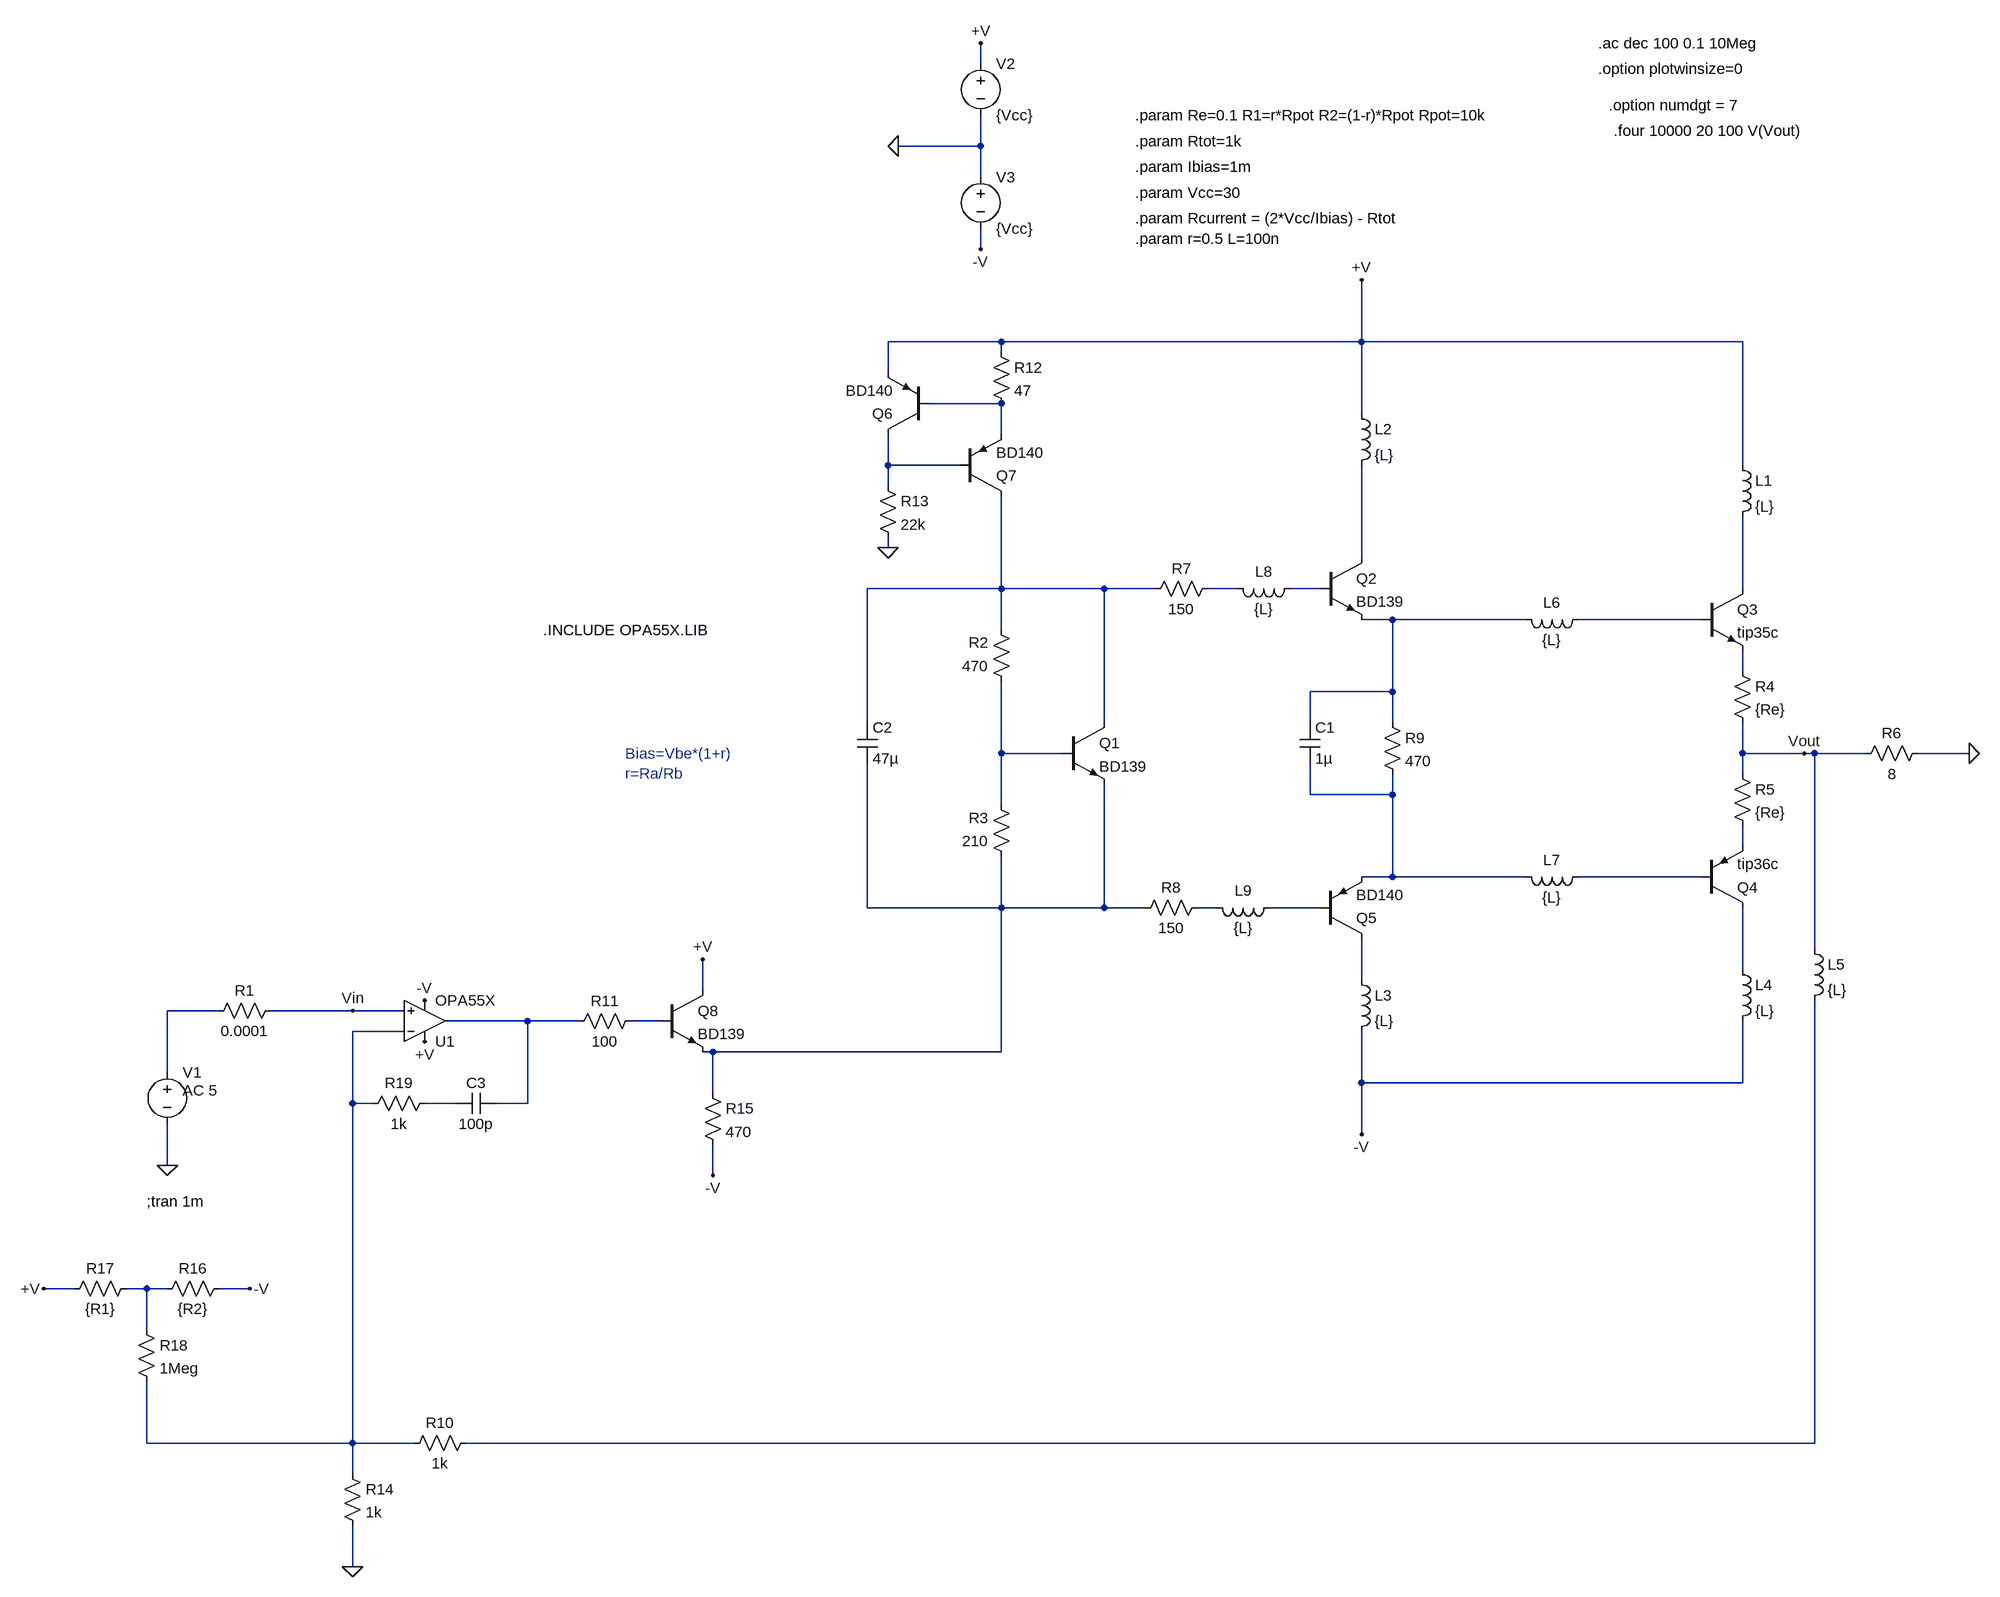
[diagram p0: schematic V3 inductance - AC.asc]
V3 inductance - AC.asc, the LTspice schematic file:
Version 4
SHEET 1 1460 1316
WIRE -96 -1664 -96 -1696
WIRE -96 -1536 -96 -1584
WIRE -96 -1536 -224 -1536
WIRE -96 -1488 -96 -1536
WIRE -96 -1376 -96 -1408
WIRE -64 -1232 -240 -1232
WIRE 496 -1232 496 -1328
WIRE 496 -1232 -64 -1232
WIRE 1088 -1232 496 -1232
WIRE -64 -1216 -64 -1232
WIRE -240 -1184 -240 -1232
WIRE -64 -1136 -176 -1136
WIRE 496 -1120 496 -1232
WIRE -64 -1088 -64 -1136
WIRE -240 -1040 -240 -1088
WIRE -128 -1040 -240 -1040
WIRE 1088 -1040 1088 -1232
WIRE -240 -1008 -240 -1040
WIRE -240 -912 -240 -928
WIRE 496 -896 496 -1040
WIRE -64 -848 -64 -992
WIRE -64 -848 -272 -848
WIRE 96 -848 -64 -848
WIRE 176 -848 96 -848
WIRE 304 -848 256 -848
WIRE 432 -848 384 -848
WIRE 1088 -848 1088 -960
WIRE 544 -800 496 -800
WIRE 752 -800 544 -800
WIRE 1024 -800 832 -800
WIRE -64 -784 -64 -848
WIRE 1088 -720 1088 -752
WIRE 544 -688 544 -800
WIRE 544 -688 416 -688
WIRE -272 -640 -272 -848
WIRE 96 -640 96 -848
WIRE 416 -640 416 -688
WIRE 544 -640 544 -688
WIRE -64 -592 -64 -704
WIRE 32 -592 -64 -592
WIRE 1088 -592 1088 -640
WIRE 1184 -592 1088 -592
WIRE 1200 -592 1184 -592
WIRE 1280 -592 1200 -592
WIRE 1440 -592 1360 -592
WIRE 1088 -560 1088 -592
WIRE 416 -528 416 -576
WIRE 544 -528 544 -560
WIRE 544 -528 416 -528
WIRE -64 -512 -64 -592
WIRE 1088 -448 1088 -480
WIRE 544 -400 544 -528
WIRE 544 -400 496 -400
WIRE 752 -400 544 -400
WIRE 1024 -400 832 -400
WIRE -272 -352 -272 -576
WIRE -64 -352 -64 -432
WIRE -64 -352 -272 -352
WIRE 96 -352 96 -544
WIRE 96 -352 -64 -352
WIRE 160 -352 96 -352
WIRE 272 -352 240 -352
WIRE 432 -352 352 -352
WIRE 1200 -288 1200 -592
WIRE 1088 -256 1088 -352
WIRE 496 -240 496 -304
WIRE -528 -224 -528 -272
WIRE -1280 -192 -1360 -192
WIRE -1072 -192 -1200 -192
WIRE -992 -192 -1072 -192
WIRE -800 -176 -928 -176
WIRE -720 -176 -800 -176
WIRE -592 -176 -640 -176
WIRE -992 -160 -1072 -160
WIRE -512 -128 -528 -128
WIRE -64 -128 -64 -352
WIRE -64 -128 -512 -128
WIRE -1360 -96 -1360 -192
WIRE 496 -80 496 -160
WIRE 1088 -80 1088 -176
WIRE 1088 -80 496 -80
WIRE -512 -64 -512 -128
WIRE -1072 -48 -1072 -160
WIRE -1040 -48 -1072 -48
WIRE -912 -48 -960 -48
WIRE -800 -48 -800 -176
WIRE -800 -48 -848 -48
WIRE 496 0 496 -80
WIRE -1360 48 -1360 -16
WIRE -512 64 -512 16
WIRE -1504 240 -1552 240
WIRE -1392 240 -1424 240
WIRE -1360 240 -1392 240
WIRE -1232 240 -1280 240
WIRE -1392 304 -1392 240
WIRE -1392 480 -1392 384
WIRE -1072 480 -1072 -48
WIRE -1072 480 -1392 480
WIRE -976 480 -1072 480
WIRE 1200 480 1200 -208
WIRE 1200 480 -896 480
WIRE -1072 528 -1072 480
WIRE -1072 672 -1072 608
FLAG 496 -1328 +V
FLAG 496 0 -V
FLAG -1360 48 0
FLAG -224 -1536 0
FLAG -96 -1696 +V
FLAG -96 -1376 -V
FLAG 1440 -592 0
FLAG 1184 -592 Vout
FLAG -960 -144 +V
FLAG -960 -208 -V
FLAG -240 -912 0
FLAG -1072 672 0
FLAG -528 -272 +V
FLAG -512 64 -V
FLAG -1552 240 +V
FLAG -1232 240 -V
FLAG -1072 -192 Vin
SYMBOL voltage -1360 -112 R0
WINDOW 123 24 44 Left 2
WINDOW 39 0 0 Left 0
SYMATTR Value2 AC 5
SYMATTR InstName V1
SYMATTR Value ""
SYMBOL res -1184 -208 R90
WINDOW 0 0 56 VBottom 2
WINDOW 3 32 56 VTop 2
SYMATTR InstName R1
SYMATTR Value 0.0001
SYMBOL res -48 -688 R180
WINDOW 0 36 76 Left 2
WINDOW 3 36 40 Left 2
SYMATTR InstName R2
SYMATTR Value 470
SYMBOL res -48 -416 R180
WINDOW 0 36 76 Left 2
WINDOW 3 36 40 Left 2
SYMATTR InstName R3
SYMATTR Value 210
SYMBOL npn 32 -640 R0
SYMATTR InstName Q1
SYMATTR Value BD139
SYMBOL npn 432 -896 R0
SYMATTR InstName Q2
SYMATTR Value BD139
SYMBOL npn 1024 -848 R0
SYMATTR InstName Q3
SYMATTR Value tip35c
SYMBOL pnp 1024 -352 M180
SYMATTR InstName Q4
SYMATTR Value tip36c
SYMBOL pnp 432 -304 M180
SYMATTR InstName Q5
SYMATTR Value BD140
SYMBOL res 1072 -736 R0
SYMATTR InstName R4
SYMATTR Value {Re}
SYMBOL res 1072 -576 R0
SYMATTR InstName R5
SYMATTR Value {Re}
SYMBOL voltage -96 -1680 R0
WINDOW 123 0 0 Left 0
WINDOW 39 0 0 Left 0
SYMATTR InstName V2
SYMATTR Value {Vcc}
SYMBOL voltage -96 -1504 R0
WINDOW 123 0 0 Left 0
WINDOW 39 0 0 Left 0
SYMATTR InstName V3
SYMATTR Value {Vcc}
SYMBOL res 1376 -608 R90
WINDOW 0 0 56 VBottom 2
WINDOW 3 32 56 VTop 2
SYMATTR InstName R6
SYMATTR Value 8
SYMBOL res 272 -864 R90
WINDOW 0 0 56 VBottom 2
WINDOW 3 32 56 VTop 2
SYMATTR InstName R7
SYMATTR Value 150
SYMBOL res 256 -368 R90
WINDOW 0 0 56 VBottom 2
WINDOW 3 32 56 VTop 2
SYMATTR InstName R8
SYMATTR Value 150
SYMBOL res 528 -656 R0
SYMATTR InstName R9
SYMATTR Value 470
SYMBOL cap 400 -640 R0
SYMATTR InstName C1
SYMATTR Value 1µ
SYMBOL cap -288 -640 R0
SYMATTR InstName C2
SYMATTR Value 47µ
SYMBOL OpAmps\\opamp2 -960 -112 M180
SYMATTR InstName U1
SYMATTR Value OPA55X
SYMBOL res -880 464 R90
WINDOW 0 0 56 VBottom 2
WINDOW 3 32 56 VTop 2
SYMATTR InstName R10
SYMATTR Value 1k
SYMBOL pnp -176 -1088 R180
SYMATTR InstName Q6
SYMATTR Value BD140
SYMBOL res -80 -1232 R0
SYMATTR InstName R12
SYMATTR Value 47
SYMBOL pnp -128 -992 M180
SYMATTR InstName Q7
SYMATTR Value BD140
SYMBOL res -256 -1024 R0
SYMATTR InstName R13
SYMATTR Value 22k
SYMBOL res -1088 512 R0
SYMATTR InstName R14
SYMATTR Value 1k
SYMBOL npn -592 -224 R0
SYMATTR InstName Q8
SYMATTR Value BD139
SYMBOL res -528 -80 R0
SYMATTR InstName R15
SYMATTR Value 470
SYMBOL res -1264 224 R90
WINDOW 0 0 56 VBottom 2
WINDOW 3 32 56 VTop 2
SYMATTR InstName R16
SYMATTR Value {R2}
SYMBOL res -1408 224 R90
WINDOW 0 0 56 VBottom 2
WINDOW 3 32 56 VTop 2
SYMATTR InstName R17
SYMATTR Value {R1}
SYMBOL res -1408 288 R0
SYMATTR InstName R18
SYMATTR Value 1Meg
SYMBOL cap -848 -64 R90
WINDOW 0 0 32 VBottom 2
WINDOW 3 32 32 VTop 2
SYMATTR InstName C3
SYMATTR Value 100p
SYMBOL ind 1072 -1056 R0
SYMATTR InstName L1
SYMATTR Value {L}
SYMBOL ind 480 -1136 R0
SYMATTR InstName L2
SYMATTR Value {L}
SYMBOL ind 480 -256 R0
SYMATTR InstName L3
SYMATTR Value {L}
SYMBOL ind 1072 -272 R0
SYMATTR InstName L4
SYMATTR Value {L}
SYMBOL ind 1184 -304 R0
SYMATTR InstName L5
SYMATTR Value {L}
SYMBOL ind 848 -816 R90
WINDOW 0 5 56 VBottom 2
WINDOW 3 32 56 VTop 2
SYMATTR InstName L6
SYMATTR Value {L}
SYMBOL ind 848 -416 R90
WINDOW 0 5 56 VBottom 2
WINDOW 3 32 56 VTop 2
SYMATTR InstName L7
SYMATTR Value {L}
SYMBOL ind 400 -864 R90
WINDOW 0 5 56 VBottom 2
WINDOW 3 32 56 VTop 2
SYMATTR InstName L8
SYMATTR Value {L}
SYMBOL ind 368 -368 R90
WINDOW 0 5 56 VBottom 2
WINDOW 3 32 56 VTop 2
SYMATTR InstName L9
SYMATTR Value {L}
SYMBOL res -624 -192 R90
WINDOW 0 0 56 VBottom 2
WINDOW 3 32 56 VTop 2
SYMATTR InstName R11
SYMATTR Value 100
SYMBOL res -944 -64 R90
WINDOW 0 0 56 VBottom 2
WINDOW 3 32 56 VTop 2
SYMATTR InstName R19
SYMATTR Value 1k
TEXT -648 -592 Left 2 ;Bias=Vbe*(1+r)\nr=Ra/Rb
TEXT 144 -1544 Left 2 !.param Rtot=1k
TEXT 144 -1504 Left 2 !.param Ibias=1m
TEXT 144 -1464 Left 2 !.param Vcc=30
TEXT 144 -1424 Left 2 !.param Rcurrent = (2*Vcc/Ibias) - Rtot
TEXT -1392 104 Left 2 !;tran 1m
TEXT 864 -1696 Left 2 !.ac dec 100 0.1 10Meg
TEXT 864 -1656 Left 2 !.option plotwinsize=0
TEXT 880 -1600 Left 2 !.option numdgt = 7
TEXT 888 -1560 Left 2 !.four 10000 20 100 V(Vout)
TEXT -776 -784 Left 2 !.INCLUDE OPA55X.LIB
TEXT 144 -1584 Left 2 !.param Re=0.1 R1=r*Rpot R2=(1-r)*Rpot Rpot=10k
TEXT 144 -1392 Left 2 !.param r=0.5 L=100n

The netlist it stands for:
* V3 inductance - AC.asc
V1 N020 0 AC 5
R1 Vin N020 0.0001
R2 N011 N004 470
R3 N015 N011 210
Q1 N004 N011 N015 0 BD139
Q2 N003 N006 N008 0 BD139
Q3 N007 N009 N010 0 tip35c
Q4 N018 N014 N013 0 tip36c
Q5 N019 N017 N012 0 BD140
R4 N010 Vout {Re}
R5 Vout N013 {Re}
V2 +V 0 {Vcc}
V3 0 -V {Vcc}
R6 0 Vout 8
R7 N005 N004 150
R8 N016 N015 150
R9 N008 N012 470
C1 N008 N012 1µ
C2 N004 N015 47µ
XU1 Vin N023 +V -V N021 OPA55X  ; pins In+ In- V+ V- OUT
R10 N026 N023 1k
Q6 N002 N001 +V 0 BD140
R12 +V N001 47
Q7 N004 N002 N001 0 BD140
R13 N002 0 22k
R14 N023 0 1k
Q8 +V N022 N015 0 BD139
R15 N015 -V 470
R16 -V N025 {R2}
R17 N025 +V {R1}
R18 N025 N023 1Meg
C3 N021 N024 100p
L1 +V N007 {L}
L2 +V N003 {L}
L3 N019 -V {L}
L4 N018 -V {L}
L5 Vout N026 {L}
L6 N009 N008 {L}
L7 N014 N012 {L}
L8 N006 N005 {L}
L9 N017 N016 {L}
R11 N022 N021 100
R19 N024 N023 1k
.model NPN NPN
.model PNP PNP
.lib standard.bjt
* Bias=Vbe*(1+r)
* r=Ra/Rb
.param Rtot=1k
.param Ibias=1m
.param Vcc=30
.param Rcurrent = (2*Vcc/Ibias) - Rtot
;tran 1m
.ac dec 100 0.1 10Meg
.option plotwinsize=0
.option numdgt = 7
.four 10000 20 100 V(Vout)
.INCLUDE OPA55X.LIB
.param Re=0.1 R1=r*Rpot R2=(1-r)*Rpot Rpot=10k
.param r=0.5 L=100n
.backanno
.end